# EAGLE board slice_v6_zp (EAGLE 7.4.0), part 1 of 2
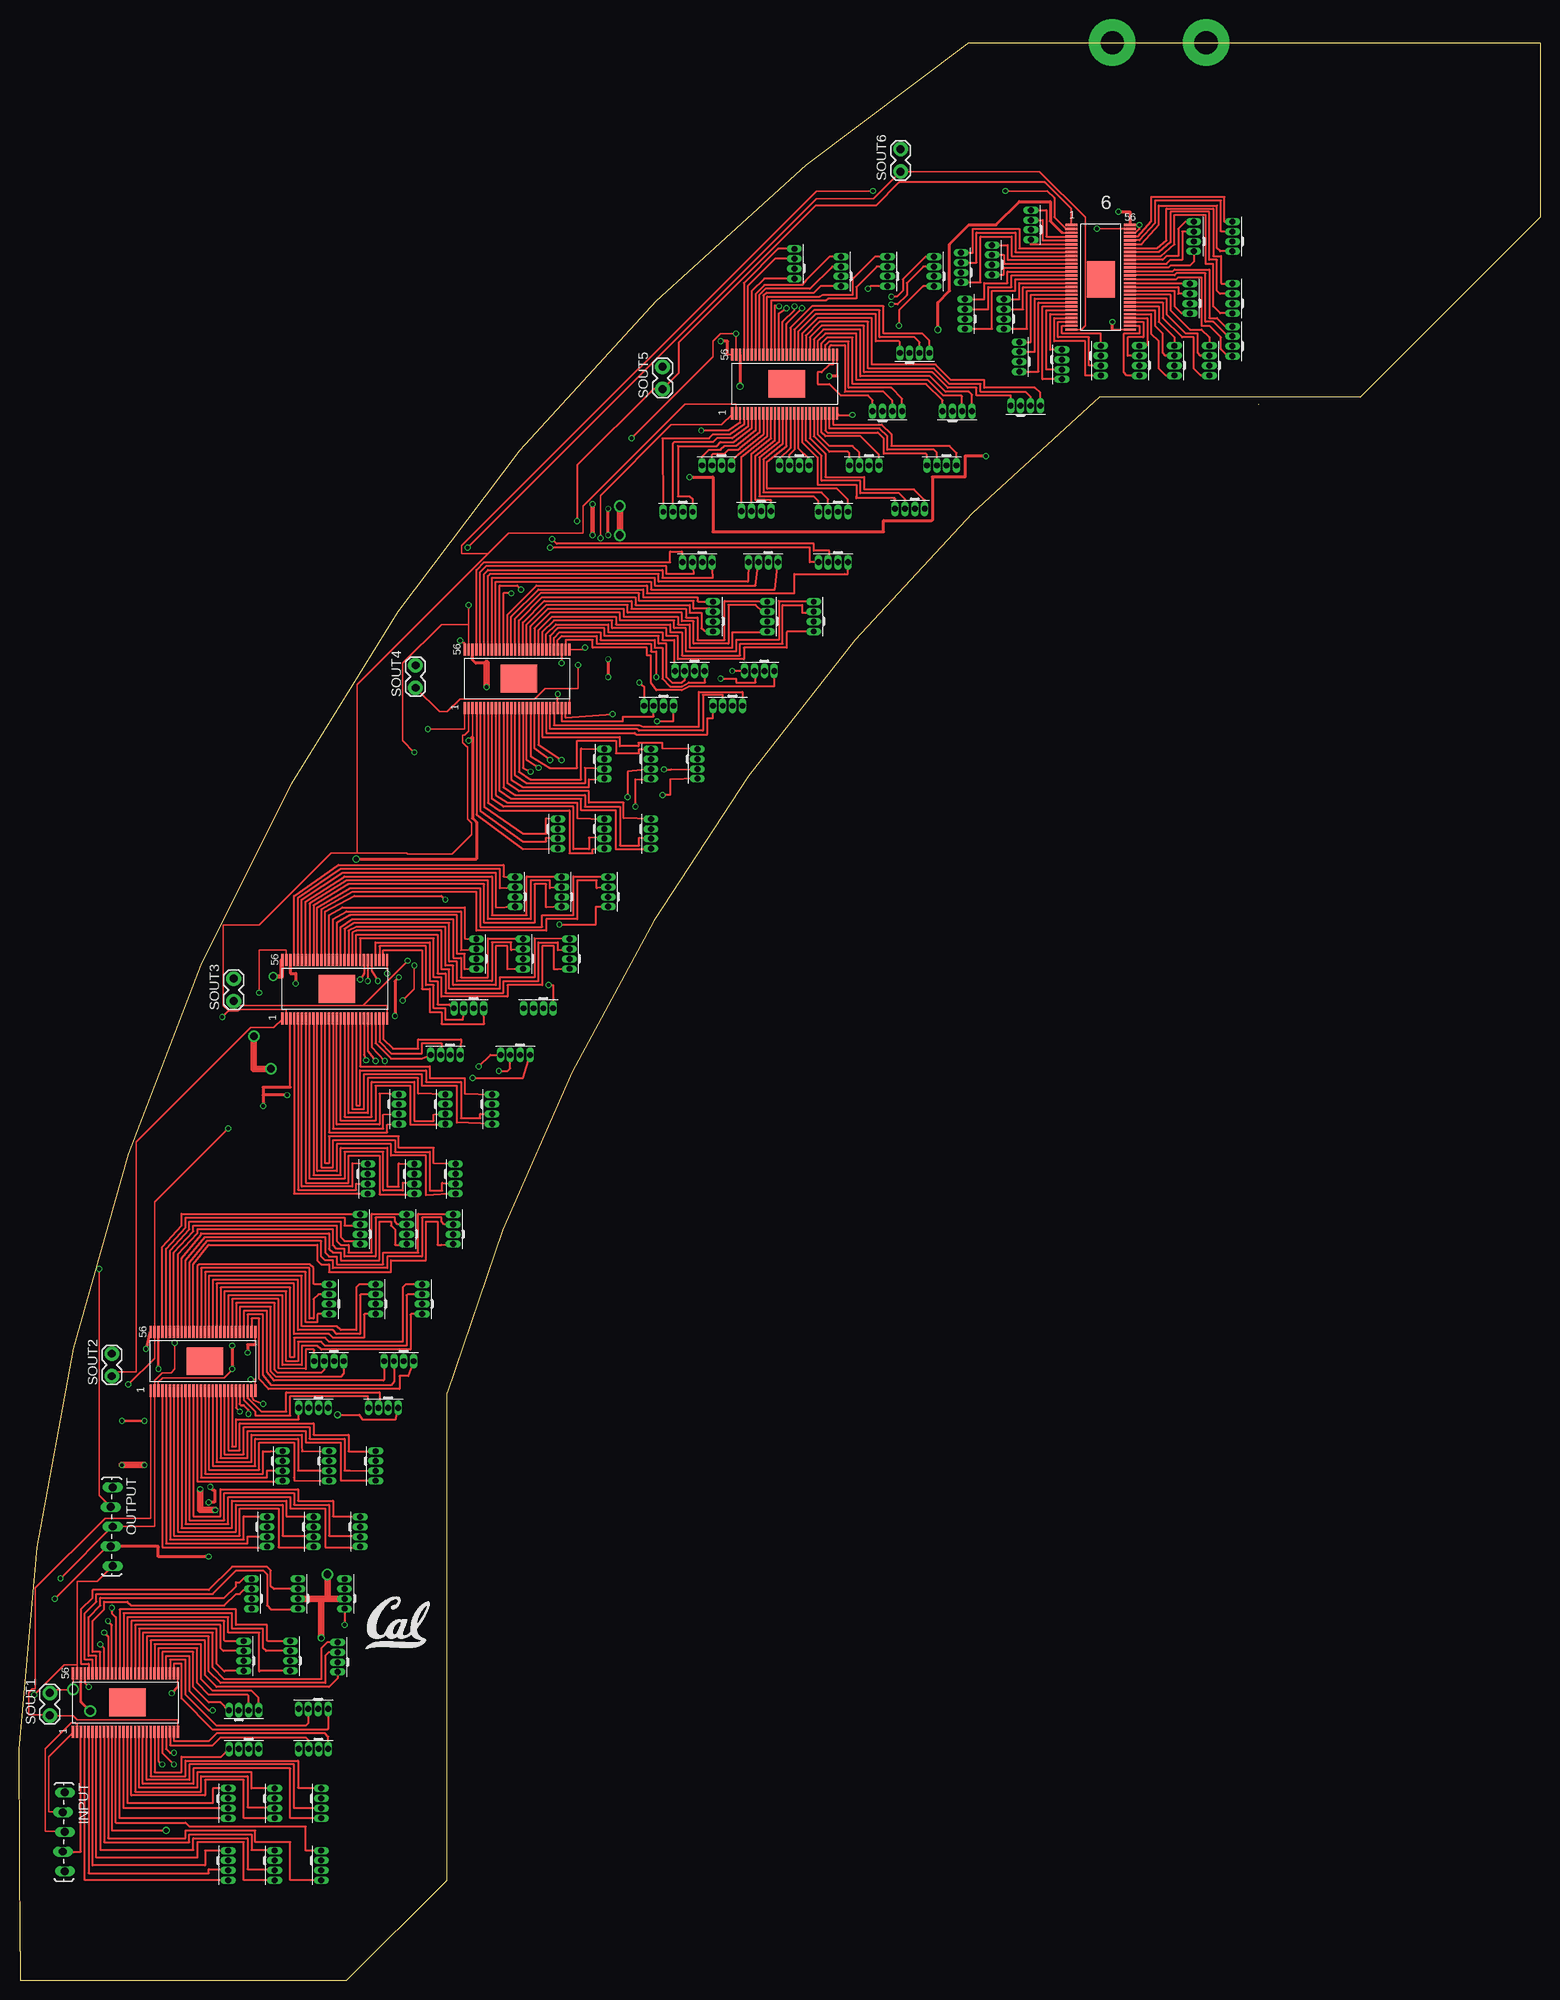
[diagram p5: board, top side]
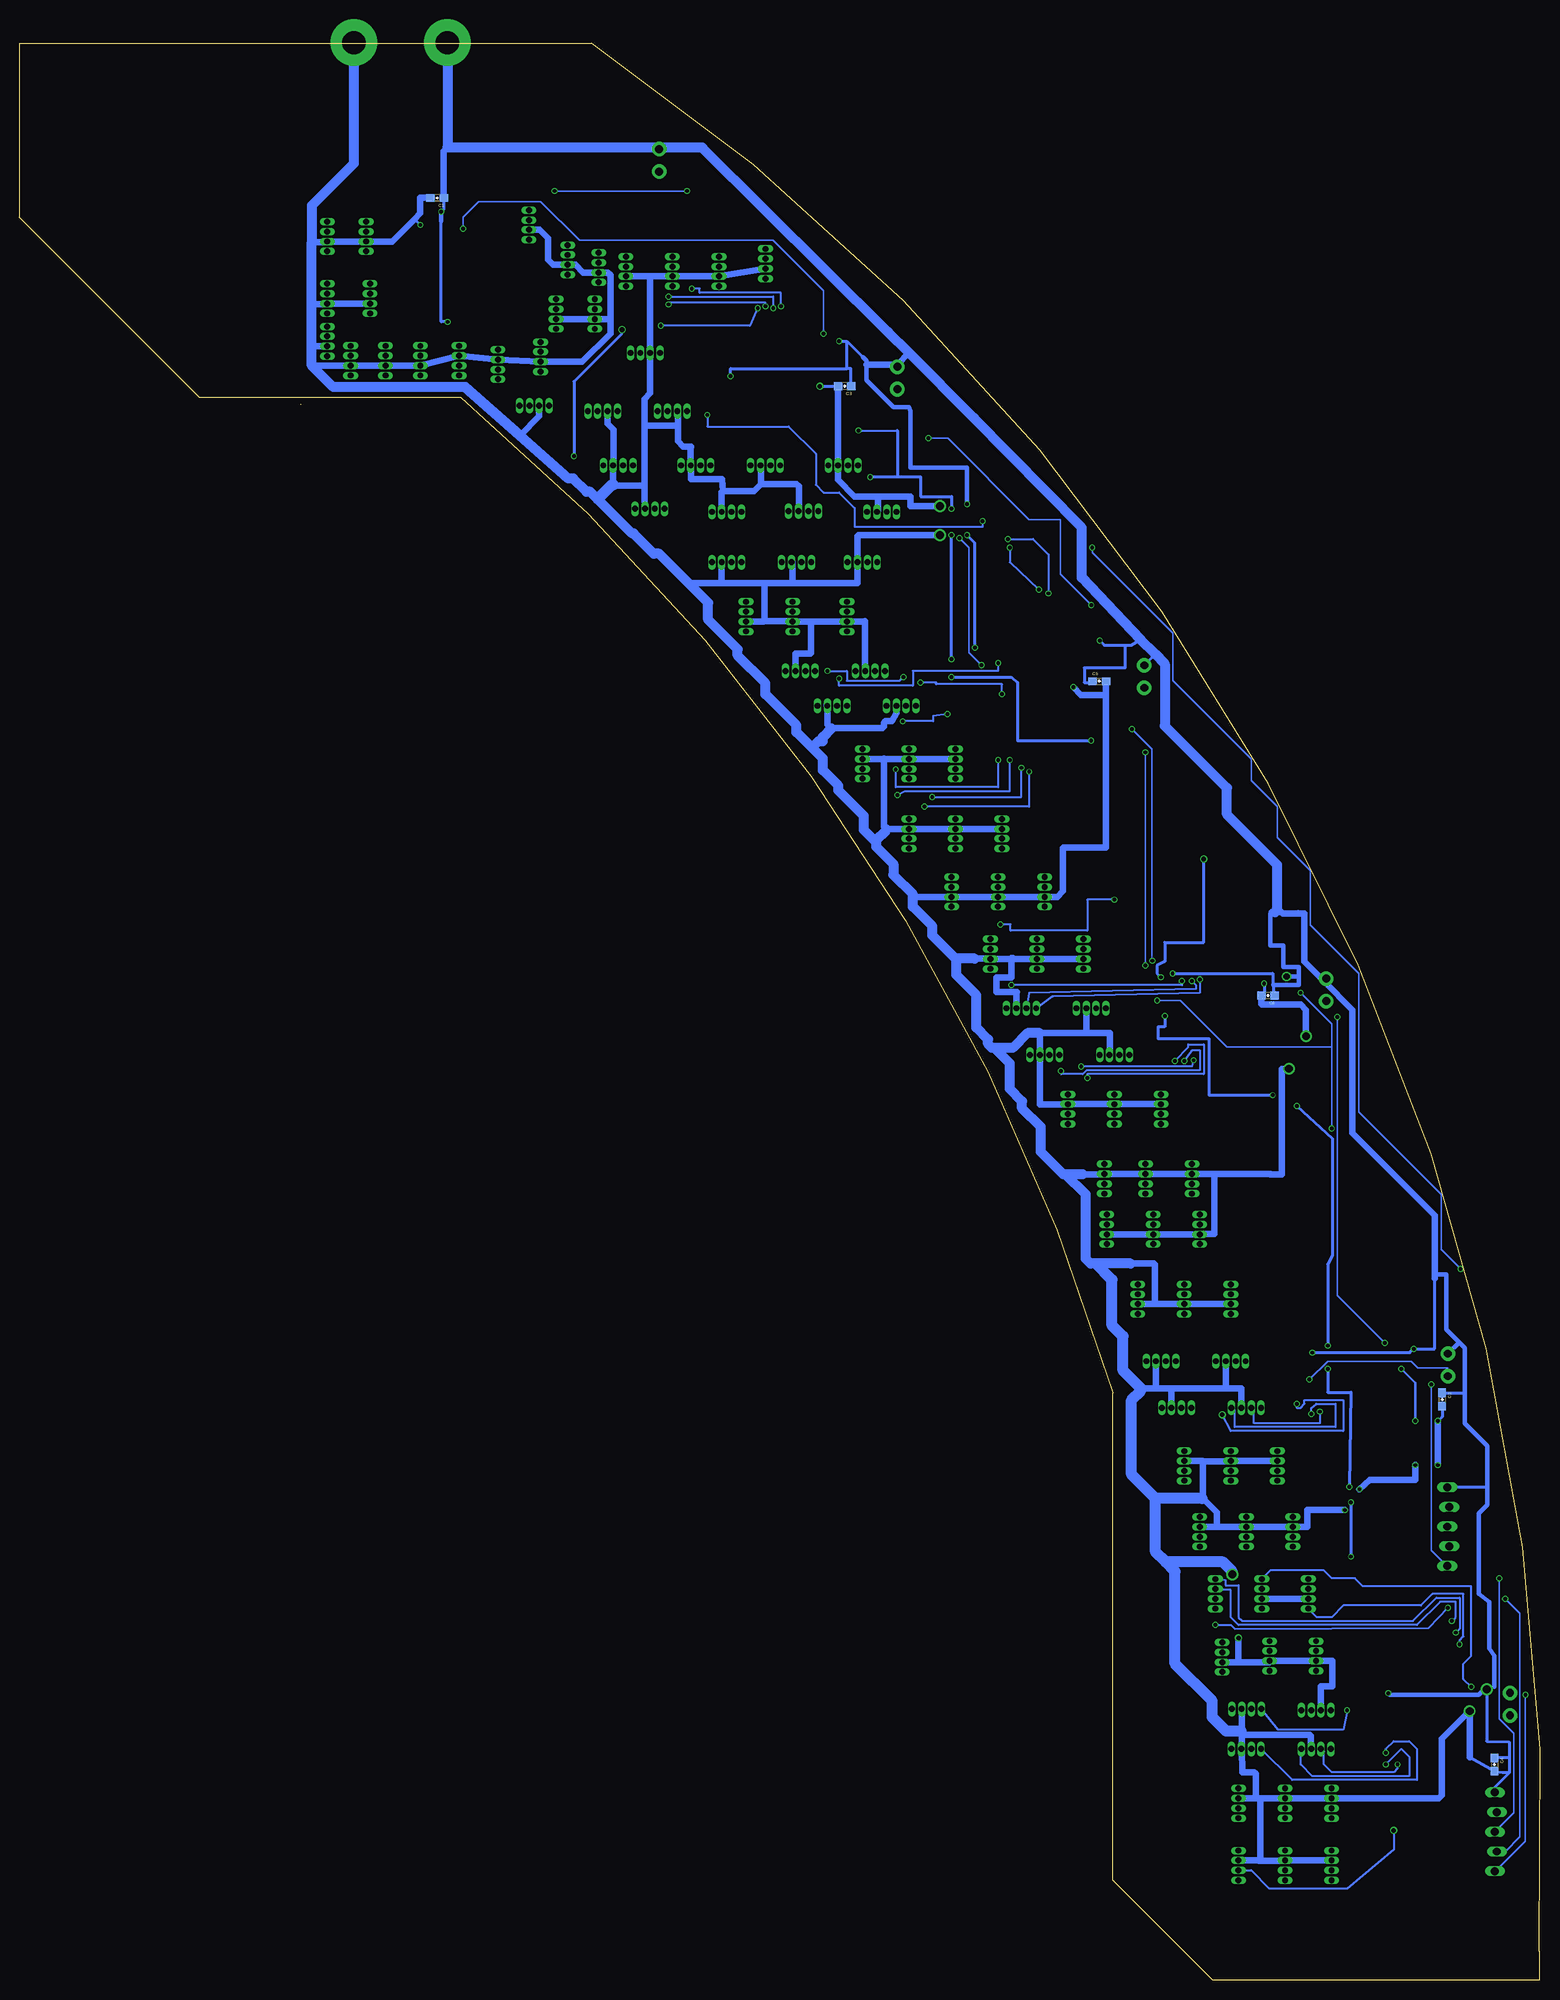
[diagram p6: board, bottom side, seen from below]

Size 196.13 x 249.7 mm. Coordinates in mm from the lower left corner, seen from the top.
Outline: 159.83,203.1 159.83,203.2
Outline: 0.13,3.7 arc-59 122.33,249.7 196.13,249.7 196.13,227.3 172.93,204.1 139.23,204.1 arc33 55.13,75.7 55.13,12.9 42.23,0 0.13,0 0.13,3.7
Copper layers (1*16): Top 0.035mm / dielectric 1.5mm / Bottom 0.035mm
Design rules "SparkFun *": minimum track width 8mil, minimum drill 20mil, track to track 8mil, track to pad 8mil, pad to pad 8mil, via to via 8mil, smd to smd 8mil, copper to edge 10mil, drill to drill 8mil, minimum pad ring 0mil, minimum via ring 0mil, stop-mask expansion 4mil, vias tented up to drill 25mil, thermal gap 10mil

## Footprints (pad centres in the part's own frame; a part is rotated, then mirrored left to right if it is on the bottom)
0603-CAP = smd 1.1 x 1: 1 -0.85,0; 2 0.85,0
56-HTSSOP = smd 0.3 x 1.55: P1 -7,-3.8; P2 -6.5,-3.8; P3 -6,-3.8; P4 -5.5,-3.8; P5 -5,-3.8; P6 -4.5,-3.8; P7 -4,-3.8; P8 -3.5,-3.8; P9 -3,-3.8; P10 -2.5,-3.8; P11 -2,-3.8; P12 -1.5,-3.8; P13 -1,-3.8; P14 -0.5,-3.8; P15 0,-3.8; P16 0.5,-3.8; P17 1,-3.8; P18 1.5,-3.8; P19 2,-3.8; P20 2.5,-3.8; P21 3,-3.8; P22 3.5,-3.8; P23 4,-3.8; P24 4.5,-3.8; P25 5,-3.8; P26 5.5,-3.8; P27 6,-3.8; P28 6.5,-3.8; P29 6.5,3.75; P30 6,3.75; P31 5.5,3.75; P32 5,3.75; P33 4.5,3.75; P34 4,3.75; P35 3.5,3.75; P36 3,3.75; P37 2.5,3.75; P38 2,3.75; P39 1.5,3.75; P40 1,3.75; P41 0.5,3.75; P42 0,3.75; P43 -0.5,3.75; P44 -1,3.75; P45 -1.5,3.75; P46 -2,3.75; P47 -2.5,3.75; P48 -3,3.75; P49 -3.5,3.75; P50 -4,3.75; P51 -4.5,3.75; P52 -5,3.75; P53 -5.5,3.75; P54 -6,3.75; P55 -6.5,3.75; P56 -7,3.75 | smd 4.7 x 3.6: POWER_PAD 0,0
LED-RGB-THRU = drill 0.762 pad 0.889 long: 1 1.905,0; 2 0.635,0; 3 -0.635,0; 4 -1.905,0
1X05_LOCK_LONGPADS = drill 1.016 long: 1 0,0; 2 2.54,-0.254; 3 5.08,0; 4 7.62,-0.254; 5 10.16,0
1X02_LOCK = drill 1.016 pad 1.88: 1 -0.178,0; 2 2.718,0
2PIN_HOLES_PWR = drill 3 pad 6: P$1 0,0; P$2 12.08,0

## Placement (x,y rotation side)
C1  0.1uF  [0603-CAP]  142.26,229.78 180 bottom
C2  0.1uF  [0603-CAP]  12.68,74.86 270 bottom
C3  0.1uF  [0603-CAP]  89.72,205.51 180 bottom
C4  0.1uF  [0603-CAP]  5.93,27.8 270 bottom
C5  0.1uF  [0603-CAP]  56.87,167.46 0 bottom
C6  0.1uF  [0603-CAP]  35.12,126.94 180 bottom
CHIP_1  TLC5955V0  [56-HTSSOP]  13.93,35.8 0 top
CHIP_2  TLC5955V0  [56-HTSSOP]  23.93,79.8 0 top
CHIP_3  TLC5955V0  [56-HTSSOP]  40.93,127.8 0 top
CHIP_4  TLC5955V0  [56-HTSSOP]  64.43,167.8 0 top
CHIP_5  TLC5955V0  [56-HTSSOP]  98.93,205.8 0 top
CHIP_6  TLC5955V0  [56-HTSSOP]  139.43,219.3 270 top
D1  LED-RGB-CC-THRUCLEAR  [LED-RGB-THRU]  150.93,216.8 270 top
D2  LED-RGB-CC-THRUCLEAR  [LED-RGB-THRU]  153.43,208.8 270 top
D3  LED-RGB-CC-THRUCLEAR  [LED-RGB-THRU]  128.93,209.3 270 top
D4  LED-RGB-CC-THRUCLEAR  [LED-RGB-THRU]  144.43,208.8 270 top
D5  LED-RGB-CC-THRUCLEAR  [LED-RGB-THRU]  156.43,224.8 270 top
D6  LED-RGB-CC-THRUCLEAR  [LED-RGB-THRU]  151.43,224.8 270 top
D7  LED-RGB-CC-THRUCLEAR  [LED-RGB-THRU]  126.93,214.8 270 top
D8  LED-RGB-CC-THRUCLEAR  [LED-RGB-THRU]  125.43,221.8 270 top
D9  LED-RGB-CC-THRUCLEAR  [LED-RGB-THRU]  148.93,208.8 270 top
D10  LED-RGB-CC-THRUCLEAR  [LED-RGB-THRU]  121.43,220.8 270 top
D11  LED-RGB-CC-THRUDIFFUSE  [LED-RGB-THRU]  121.93,214.8 270 top
D12  LED-RGB-CC-THRUCLEAR  [LED-RGB-THRU]  139.43,208.8 90 top
D13  LED-RGB-CC-THRUCLEAR  [LED-RGB-THRU]  156.43,211.3 270 top
D14  LED-RGB-CC-THRUCLEAR  [LED-RGB-THRU]  156.43,216.8 270 top
D15  LED-RGB-CC-THRUCLEAR  [LED-RGB-THRU]  134.43,208.3 90 top
D16  LED-RGB-CC-THRUCLEAR  [LED-RGB-THRU]  130.43,226.3 270 top
D17  LED-RGB-CC-THRUCLEAR  [LED-RGB-THRU]  96.43,175.8 270 top
D18  LED-RGB-CC-THRUCLEAR  [LED-RGB-THRU]  102.43,175.8 270 top
D19  LED-RGB-CC-THRUCLEAR  [LED-RGB-THRU]  87.43,156.8 90 top
D20  LED-RGB-CC-THRUCLEAR  [LED-RGB-THRU]  95.43,168.8 0 top
D21  LED-RGB-CC-THRUCLEAR  [LED-RGB-THRU]  87.43,182.8 0 top
D22  LED-RGB-CC-THRUCLEAR  [LED-RGB-THRU]  104.93,182.8 0 top
D23  LED-RGB-CC-THRUCLEAR  [LED-RGB-THRU]  81.43,156.8 90 top
D24  LED-RGB-CC-THRUCLEAR  [LED-RGB-THRU]  81.43,147.8 90 top
D25  LED-RGB-CC-THRUCLEAR  [LED-RGB-THRU]  86.43,168.8 0 top
D26  LED-RGB-CC-THRUCLEAR  [LED-RGB-THRU]  75.43,147.8 90 top
D27  LED-RGB-CC-THRUCLEAR  [LED-RGB-THRU]  75.43,156.8 90 top
D28  LED-RGB-CC-THRUCLEAR  [LED-RGB-THRU]  82.43,164.3 0 top
D29  LED-RGB-CC-THRUCLEAR  [LED-RGB-THRU]  89.43,175.8 270 top
D30  LED-RGB-CC-THRUCLEAR  [LED-RGB-THRU]  95.93,182.8 0 top
D31  LED-RGB-CC-THRUCLEAR  [LED-RGB-THRU]  91.33,164.3 0 top
D32  LED-RGB-CC-THRUCLEAR  [LED-RGB-THRU]  69.43,147.8 90 top
D33  LED-RGB-CC-THRUCLEAR  [LED-RGB-THRU]  115.43,209.8 180 top
D34  LED-RGB-CC-THRUCLEAR  [LED-RGB-THRU]  129.73,203 180 top
D35  1  [LED-RGB-THRU]  114.83,189.7 0 top
D36  LED-RGB-CC-THRUCLEAR  [LED-RGB-THRU]  111.93,202.3 180 top
D37  LED-RGB-CC-THRUCLEAR  [LED-RGB-THRU]  99.93,221.3 270 top
D38  LED-RGB-CC-THRUCLEAR  [LED-RGB-THRU]  111.93,220.3 270 top
D39  LED-RGB-CC-THRUCLEAR  [LED-RGB-THRU]  99.93,195.3 0 top
D40  LED-RGB-CC-THRUCLEAR  [LED-RGB-THRU]  95.03,189.4 0 top
D41  LED-RGB-CC-THRUCLEAR  [LED-RGB-THRU]  120.93,202.3 180 top
D42  LED-RGB-CC-THRUCLEAR  [LED-RGB-THRU]  89.93,195.3 0 top
D43  LED-RGB-CC-THRUCLEAR  [LED-RGB-THRU]  104.93,189.3 0 top
D44  LED-RGB-CC-THRUCLEAR  [LED-RGB-THRU]  118.93,195.3 0 top
D45  LED-RGB-CC-THRUCLEAR  [LED-RGB-THRU]  117.93,220.3 270 top
D46  LED-RGB-CC-THRUCLEAR  [LED-RGB-THRU]  105.93,220.3 270 top
D47  LED-RGB-CC-THRUCLEAR  [LED-RGB-THRU]  108.93,195.3 0 top
D48  LED-RGB-CC-THRUCLEAR  [LED-RGB-THRU]  84.93,189.3 0 top
D49  LED-RGB-CC-THRUCLEAR  [LED-RGB-THRU]  28.93,41.8 270 top
D50  LED-RGB-CC-THRUCLEAR  [LED-RGB-THRU]  41.03,41.63 270 top
D51  LED-RGB-CC-THRUCLEAR  [LED-RGB-THRU]  38.93,22.8 90 top
D52  LED-RGB-CC-THRUCLEAR  [LED-RGB-THRU]  37.89,34.96 0 top
D53  LED-RGB-CC-THRUCLEAR  [LED-RGB-THRU]  35.93,49.8 270 top
D54  LED-RGB-CC-THRUCLEAR  [LED-RGB-THRU]  41.93,49.8 270 top
D55  LED-RGB-CC-THRUCLEAR  [LED-RGB-THRU]  32.93,22.8 90 top
D56  LED-RGB-CC-THRUCLEAR  [LED-RGB-THRU]  38.93,14.8 90 top
D57  LED-RGB-CC-THRUCLEAR  [LED-RGB-THRU]  28.93,34.8 180 top
D58  LED-RGB-CC-THRUCLEAR  [LED-RGB-THRU]  32.93,14.8 90 top
D59  LED-RGB-CC-THRUCLEAR  [LED-RGB-THRU]  26.93,22.8 90 top
D60  LED-RGB-CC-THRUCLEAR  [LED-RGB-THRU]  37.93,29.8 0 top
D61  LED-RGB-CC-THRUCLEAR  [LED-RGB-THRU]  34.93,41.8 270 top
D62  LED-RGB-CC-THRUCLEAR  [LED-RGB-THRU]  29.93,49.8 270 top
D63  LED-RGB-CC-THRUCLEAR  [LED-RGB-THRU]  28.93,29.8 0 top
D64  LED-RGB-CC-THRUCLEAR  [LED-RGB-THRU]  26.93,14.8 90 top
D65  LED-RGB-CC-THRUCLEAR  [LED-RGB-THRU]  45.93,87.8 270 top
D66  LED-RGB-CC-THRUCLEAR  [LED-RGB-THRU]  51.93,87.8 270 top
D67  LED-RGB-CC-THRUCLEAR  [LED-RGB-THRU]  45.93,66.3 90 top
D68  LED-RGB-CC-THRUCLEAR  [LED-RGB-THRU]  48.93,79.8 0 top
D69  LED-RGB-CC-THRUCLEAR  [LED-RGB-THRU]  43.93,96.8 270 top
D70  LED-RGB-CC-THRUCLEAR  [LED-RGB-THRU]  55.93,96.8 270 top
D71  LED-RGB-CC-THRUCLEAR  [LED-RGB-THRU]  39.93,66.3 90 top
D72  LED-RGB-CC-THRUCLEAR  [LED-RGB-THRU]  43.93,57.8 90 top
D73  LED-RGB-CC-THRUCLEAR  [LED-RGB-THRU]  39.93,79.8 0 top
D74  LED-RGB-CC-THRUCLEAR  [LED-RGB-THRU]  37.93,57.8 90 top
D75  LED-RGB-CC-THRUCLEAR  [LED-RGB-THRU]  33.93,66.3 90 top
D76  LED-RGB-CC-THRUCLEAR  [LED-RGB-THRU]  46.93,73.8 0 top
D77  LED-RGB-CC-THRUCLEAR  [LED-RGB-THRU]  39.93,87.8 270 top
D78  LED-RGB-CC-THRUCLEAR  [LED-RGB-THRU]  49.93,96.8 270 top
D79  LED-RGB-CC-THRUCLEAR  [LED-RGB-THRU]  37.93,73.8 0 top
D80  LED-RGB-CC-THRUCLEAR  [LED-RGB-THRU]  31.93,57.8 90 top
D81  LED-RGB-CC-THRUCLEAR  [LED-RGB-THRU]  64.93,132.3 270 top
D82  LED-RGB-CC-THRUCLEAR  [LED-RGB-THRU]  70.93,132.3 270 top
D83  LED-RGB-CC-THRUCLEAR  [LED-RGB-THRU]  60.93,112.3 90 top
D84  LED-RGB-CC-THRUCLEAR  [LED-RGB-THRU]  57.93,125.3 0 top
D85  LED-RGB-CC-THRUCLEAR  [LED-RGB-THRU]  63.93,140.3 270 top
D86  LED-RGB-CC-THRUCLEAR  [LED-RGB-THRU]  75.93,140.3 270 top
D87  LED-RGB-CC-THRUCLEAR  [LED-RGB-THRU]  54.93,112.3 90 top
D88  LED-RGB-CC-THRUCLEAR  [LED-RGB-THRU]  56.23,103.3 90 top
D89  LED-RGB-CC-THRUCLEAR  [LED-RGB-THRU]  66.93,125.3 0 top
D90  LED-RGB-CC-THRUCLEAR  [LED-RGB-THRU]  50.93,103.3 90 top
D91  LED-RGB-CC-THRUCLEAR  [LED-RGB-THRU]  48.93,112.3 90 top
D92  LED-RGB-CC-THRUCLEAR  [LED-RGB-THRU]  54.93,119.3 0 top
D93  LED-RGB-CC-THRUCLEAR  [LED-RGB-THRU]  58.93,132.3 270 top
D94  LED-RGB-CC-THRUCLEAR  [LED-RGB-THRU]  69.93,140.3 270 top
D95  LED-RGB-CC-THRUCLEAR  [LED-RGB-THRU]  63.93,119.3 0 top
D96  LED-RGB-CC-THRUCLEAR  [LED-RGB-THRU]  44.93,103.3 90 top
INPUT  [1X05_LOCK_LONGPADS]  5.86,24.2 270 top
OUTPUT  [1X05_LOCK_LONGPADS]  12.02,63.55 270 top
SOUT1  [1X02_LOCK]  3.93,34.3 90 top
SOUT2  [1X02_LOCK]  11.93,78.05 90 top
SOUT3  [1X02_LOCK]  27.63,126.4 90 top
SOUT4  [1X02_LOCK]  51.08,166.8 90 top
SOUT5  [1X02_LOCK]  82.93,205.3 90 top
SOUT6  [1X02_LOCK]  113.63,233.36 90 top
U$1  2PIN_PWR3-6-12MM  [2PIN_HOLES_PWR]  140.93,249.8 0 top